# EAGLE board Led_panel_v2.0 (EAGLE 9.5.2)
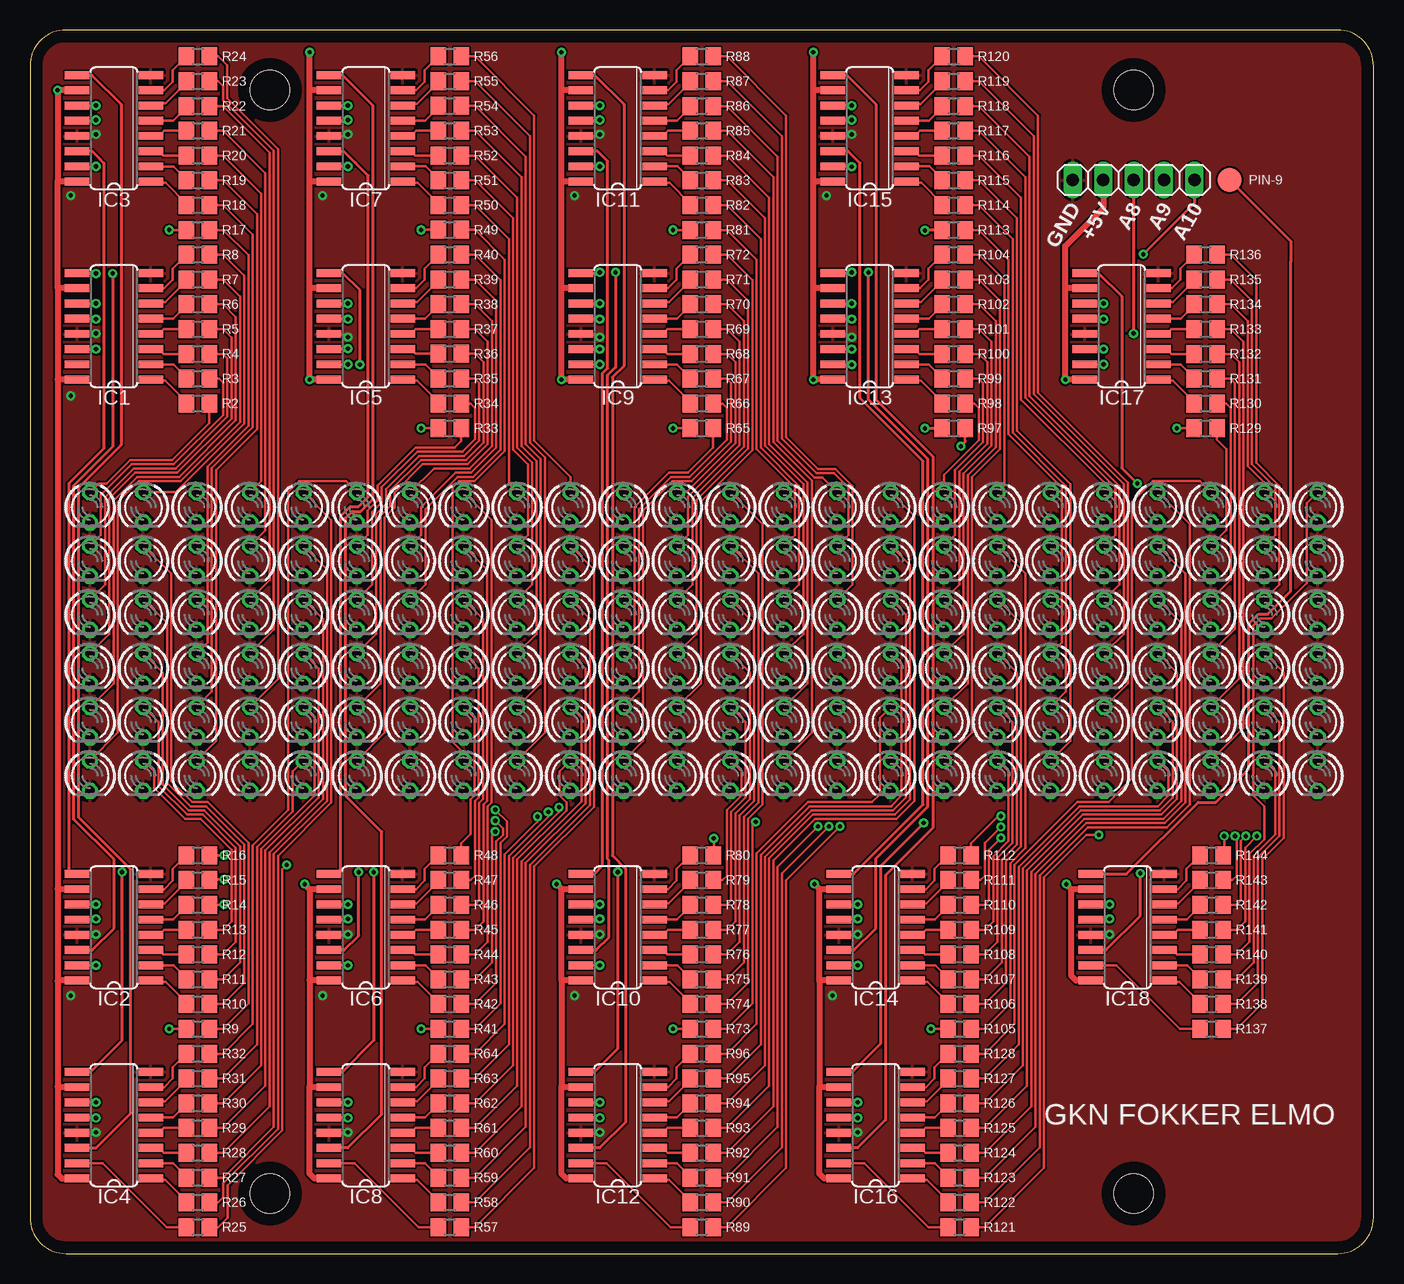
[diagram p1: board, top side]
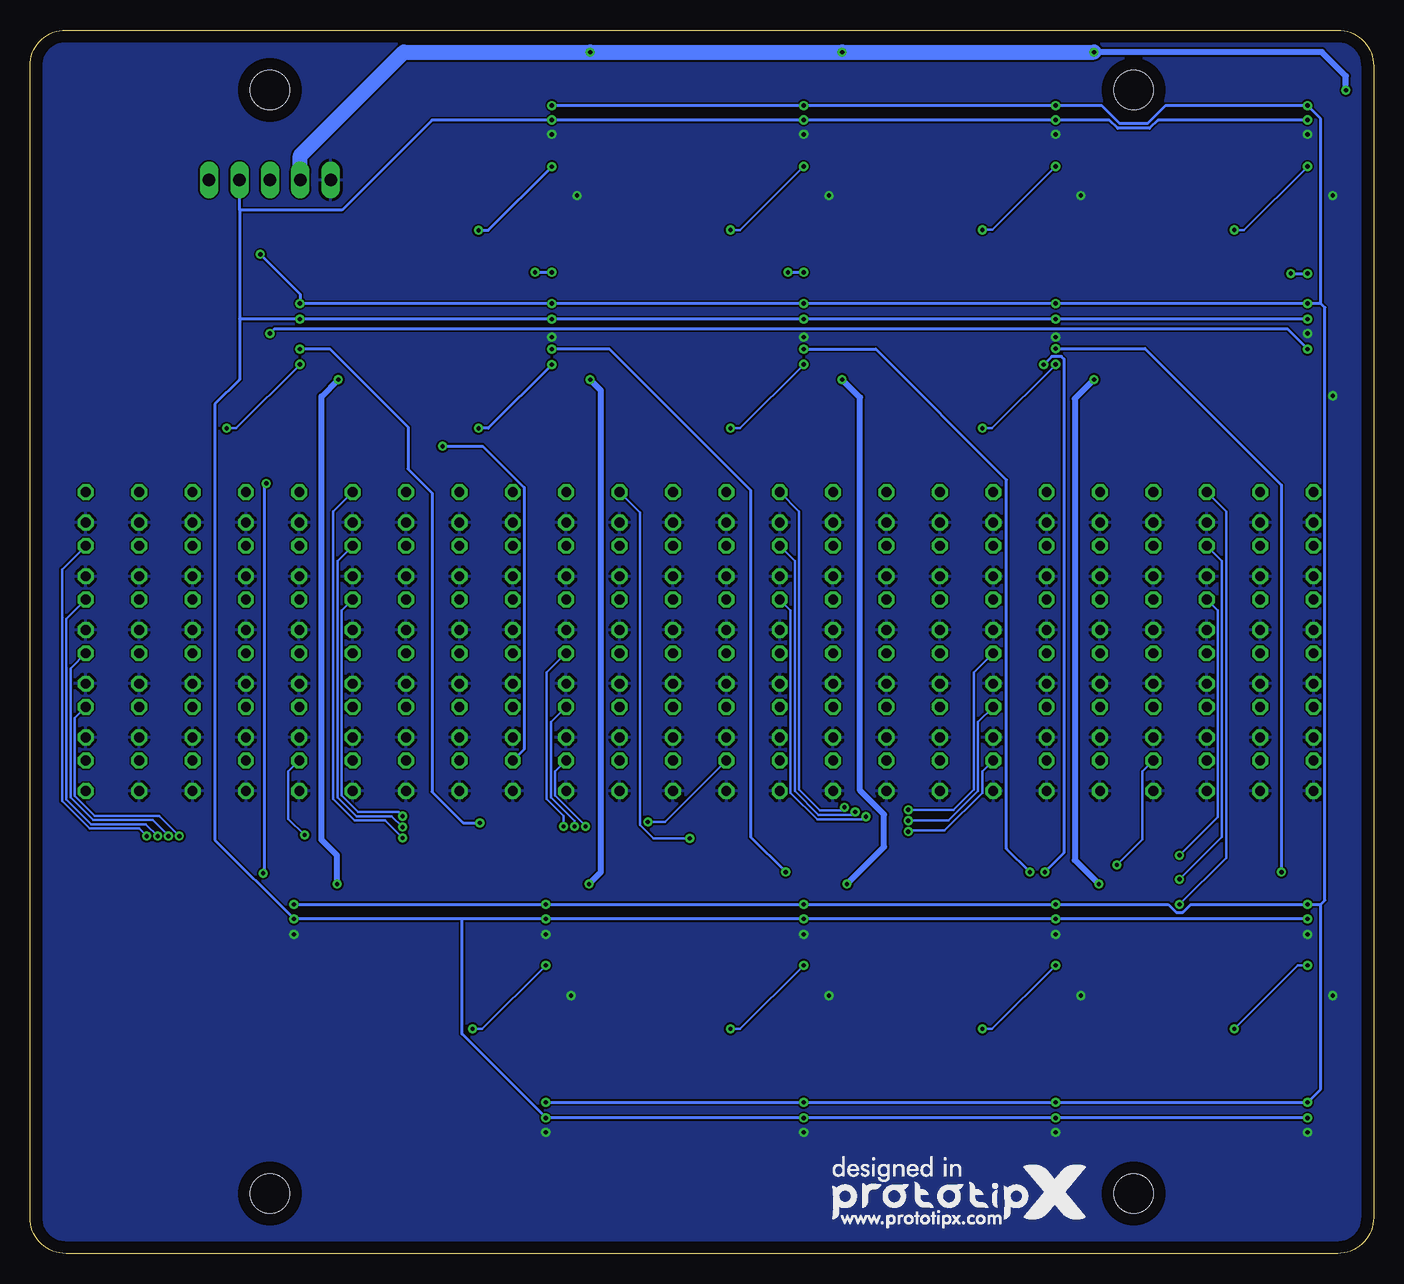
[diagram p2: board, bottom side, seen from below]

Size 112 x 102 mm. Coordinates in mm from the lower left corner, seen from the top.
Outline: 3,0 109,0 arc90 112,3 112,99 arc90 109,102 3,102 arc90 0,99 0,3 arc90 3,0
Copper layers (1*16): Top 0.035mm / dielectric 1.5mm / Bottom 0.035mm
Design rules "default": minimum track width 6mil, minimum drill 0.35mm, track to track 6mil, track to pad 6mil, pad to pad 6mil, via to via 6mil, smd to smd 6mil, copper to edge 40mil, drill to drill 6mil, minimum pad ring 10mil, minimum via ring 8mil, stop-mask expansion 4mil, vias tented up to drill 0mil, thermal gap 10mil
Holes 3.3 mm at 20,5 92,5 92,97 20,97

## Footprints (pad centres in the part's own frame; a part is rotated, then mirrored left to right if it is on the bottom)
SO16 = smd 0.66 x 2.032: 1 -4.445,-3.073; 2 -3.175,-3.073; 3 -1.905,-3.073; 4 -0.635,-3.073; 5 0.635,-3.073; 6 1.905,-3.073; 7 3.175,-3.073; 8 4.445,-3.073; 9 4.445,3.073; 10 3.175,3.073; 11 1.905,3.073; 12 0.635,3.073; 13 -0.635,3.073; 14 -1.905,3.073; 15 -3.175,3.073; 16 -4.445,3.073
1X05 = drill 1.016 long: 1 -5.08,0; 2 -2.54,0; 3 0,0; 4 2.54,0; 5 5.08,0
LED3MM = drill 0.813 octagon: A -1.27,0; K 1.27,0
TP20R = smd 2 x 2: TP 0,0
R0805 = smd 1.3 x 1.5: 1 -0.95,0; 2 0.95,0

## Placement (x,y rotation side)
IC1  74HC595D  [SO16]  7,77.3 90 top
IC2  74HC595D  [SO16]  7,27.2 90 top
IC3  74HC595D  [SO16]  7,93.8 90 top
IC4  74HC595D  [SO16]  7,10.7 90 top
IC5  74HC595D  [SO16]  28,77.3 90 top
IC6  74HC595D  [SO16]  28,27.2 90 top
IC7  74HC595D  [SO16]  28,93.8 90 top
IC8  74HC595D  [SO16]  28,10.7 90 top
IC9  74HC595D  [SO16]  49,77.3 90 top
IC10  74HC595D  [SO16]  49,27.2 90 top
IC11  74HC595D  [SO16]  49,93.8 90 top
IC12  74HC595D  [SO16]  49,10.7 90 top
IC13  74HC595D  [SO16]  70,77.3 90 top
IC14  74HC595D  [SO16]  70.5,27.2 90 top
IC15  74HC595D  [SO16]  70,93.8 90 top
IC16  74HC595D  [SO16]  70.5,10.7 90 top
IC17  74HC595D  [SO16]  91,77.3 90 top
IC18  74HC595D  [SO16]  91.5,27.2 90 top
JP1  [1X05]  92,89.5 0 top
LED1  [LED3MM]  107.35,39.83 270 top
LED2  [LED3MM]  5,62.2 270 top
LED3  [LED3MM]  5,57.73 270 top
LED4  [LED3MM]  5,53.25 270 top
LED5  [LED3MM]  5,48.77 270 top
LED6  [LED3MM]  5,44.3 270 top
LED7  [LED3MM]  5,39.83 270 top
LED8  [LED3MM]  9.45,62.2 270 top
LED9  [LED3MM]  9.45,57.73 270 top
LED10  [LED3MM]  9.45,53.25 270 top
LED11  [LED3MM]  9.45,48.77 270 top
LED12  [LED3MM]  9.45,44.3 270 top
LED13  [LED3MM]  9.45,39.83 270 top
LED14  [LED3MM]  13.9,62.2 270 top
LED15  [LED3MM]  13.9,57.73 270 top
LED16  [LED3MM]  13.9,53.25 270 top
LED17  [LED3MM]  13.9,48.77 270 top
LED18  [LED3MM]  13.9,44.3 270 top
LED19  [LED3MM]  13.9,39.83 270 top
LED20  [LED3MM]  18.35,62.2 270 top
LED21  [LED3MM]  18.35,57.73 270 top
LED22  [LED3MM]  18.35,53.25 270 top
LED23  [LED3MM]  18.35,48.77 270 top
LED24  [LED3MM]  18.35,44.3 270 top
LED25  [LED3MM]  18.35,39.83 270 top
LED26  [LED3MM]  22.8,62.2 270 top
LED27  [LED3MM]  22.8,57.73 270 top
LED28  [LED3MM]  22.8,53.25 270 top
LED29  [LED3MM]  22.8,48.77 270 top
LED30  [LED3MM]  22.8,44.3 270 top
LED31  [LED3MM]  22.8,39.83 270 top
LED32  [LED3MM]  27.25,62.2 270 top
LED33  [LED3MM]  27.25,57.73 270 top
LED34  [LED3MM]  27.25,53.25 270 top
LED35  [LED3MM]  27.25,48.77 270 top
LED36  [LED3MM]  27.25,44.3 270 top
LED37  [LED3MM]  27.25,39.83 270 top
LED38  [LED3MM]  31.7,62.2 270 top
LED39  [LED3MM]  31.7,57.73 270 top
LED40  [LED3MM]  31.7,53.25 270 top
LED41  [LED3MM]  31.7,48.77 270 top
LED42  [LED3MM]  31.7,44.3 270 top
LED43  [LED3MM]  31.7,39.83 270 top
LED44  [LED3MM]  36.15,62.2 270 top
LED45  [LED3MM]  36.15,57.73 270 top
LED46  [LED3MM]  36.15,53.25 270 top
LED47  [LED3MM]  36.15,48.77 270 top
LED48  [LED3MM]  36.15,44.3 270 top
LED49  [LED3MM]  36.15,39.83 270 top
LED50  [LED3MM]  40.6,62.2 270 top
LED51  [LED3MM]  40.6,57.73 270 top
LED52  [LED3MM]  40.6,53.25 270 top
LED53  [LED3MM]  40.6,48.77 270 top
LED54  [LED3MM]  40.6,44.3 270 top
LED55  [LED3MM]  40.6,39.83 270 top
LED56  [LED3MM]  45.05,62.2 270 top
LED57  [LED3MM]  45.05,57.73 270 top
LED58  [LED3MM]  45.05,53.25 270 top
LED59  [LED3MM]  45.05,48.77 270 top
LED60  [LED3MM]  45.05,44.3 270 top
LED61  [LED3MM]  45.05,39.83 270 top
LED62  [LED3MM]  49.5,62.2 270 top
LED63  [LED3MM]  49.5,57.73 270 top
LED64  [LED3MM]  49.5,53.25 270 top
LED65  [LED3MM]  49.5,48.77 270 top
LED66  [LED3MM]  49.5,44.3 270 top
LED67  [LED3MM]  49.5,39.83 270 top
LED68  [LED3MM]  53.95,62.2 270 top
LED69  [LED3MM]  53.95,57.73 270 top
LED70  [LED3MM]  53.95,53.25 270 top
LED71  [LED3MM]  53.95,48.77 270 top
LED72  [LED3MM]  53.95,44.3 270 top
LED73  [LED3MM]  53.95,39.83 270 top
LED74  [LED3MM]  58.4,62.2 270 top
LED75  [LED3MM]  58.4,57.73 270 top
LED76  [LED3MM]  58.4,53.25 270 top
LED77  [LED3MM]  58.4,48.77 270 top
LED78  [LED3MM]  58.4,44.3 270 top
LED79  [LED3MM]  58.4,39.83 270 top
LED80  [LED3MM]  62.85,62.2 270 top
LED81  [LED3MM]  62.85,57.73 270 top
LED82  [LED3MM]  62.85,53.25 270 top
LED83  [LED3MM]  62.85,48.77 270 top
LED84  [LED3MM]  62.85,44.3 270 top
LED85  [LED3MM]  62.85,39.83 270 top
LED86  [LED3MM]  67.3,62.2 270 top
LED87  [LED3MM]  67.3,57.73 270 top
LED88  [LED3MM]  67.3,53.25 270 top
LED89  [LED3MM]  67.3,48.77 270 top
LED90  [LED3MM]  67.3,44.3 270 top
LED91  [LED3MM]  67.3,39.83 270 top
LED92  [LED3MM]  71.75,62.2 270 top
LED93  [LED3MM]  71.75,57.73 270 top
LED94  [LED3MM]  71.75,53.25 270 top
LED95  [LED3MM]  71.75,48.77 270 top
LED96  [LED3MM]  71.75,44.3 270 top
LED97  [LED3MM]  71.75,39.83 270 top
LED98  [LED3MM]  76.2,62.2 270 top
LED99  [LED3MM]  76.2,57.73 270 top
LED100  [LED3MM]  76.2,53.25 270 top
LED101  [LED3MM]  76.2,48.77 270 top
LED102  [LED3MM]  76.2,44.3 270 top
LED103  [LED3MM]  76.2,39.83 270 top
LED104  [LED3MM]  80.65,62.2 270 top
LED105  [LED3MM]  80.65,57.73 270 top
LED106  [LED3MM]  80.65,53.25 270 top
LED107  [LED3MM]  80.65,48.77 270 top
LED108  [LED3MM]  80.65,44.3 270 top
LED109  [LED3MM]  80.65,39.83 270 top
LED110  [LED3MM]  85.1,62.2 270 top
LED111  [LED3MM]  85.1,57.73 270 top
LED112  [LED3MM]  85.1,53.25 270 top
LED113  [LED3MM]  85.1,48.77 270 top
LED114  [LED3MM]  85.1,44.3 270 top
LED115  [LED3MM]  85.1,39.83 270 top
LED116  [LED3MM]  89.55,62.2 270 top
LED117  [LED3MM]  89.55,57.73 270 top
LED118  [LED3MM]  89.55,53.25 270 top
LED119  [LED3MM]  89.55,48.77 270 top
LED120  [LED3MM]  89.55,44.3 270 top
LED121  [LED3MM]  89.55,39.83 270 top
LED122  [LED3MM]  94,62.2 270 top
LED123  [LED3MM]  94,57.73 270 top
LED124  [LED3MM]  94,53.25 270 top
LED125  [LED3MM]  94,48.77 270 top
LED126  [LED3MM]  94,44.3 270 top
LED127  [LED3MM]  94,39.83 270 top
LED128  [LED3MM]  98.45,62.2 270 top
LED129  [LED3MM]  98.45,57.73 270 top
LED130  [LED3MM]  98.45,53.25 270 top
LED131  [LED3MM]  98.45,48.77 270 top
LED132  [LED3MM]  98.45,44.3 270 top
LED133  [LED3MM]  98.45,39.83 270 top
LED134  [LED3MM]  102.9,62.2 270 top
LED135  [LED3MM]  102.9,57.73 270 top
LED136  [LED3MM]  102.9,53.25 270 top
LED137  [LED3MM]  102.9,48.77 270 top
LED138  [LED3MM]  102.9,44.3 270 top
LED139  [LED3MM]  102.9,39.83 270 top
LED140  [LED3MM]  107.35,62.2 270 top
LED141  [LED3MM]  107.35,57.73 270 top
LED142  [LED3MM]  107.35,53.25 270 top
LED143  [LED3MM]  107.35,48.77 270 top
LED144  [LED3MM]  107.35,44.3 270 top
PIN-9  PTR1TP20R  [TP20R]  100,89.5 0 top
R2  120R  [R0805]  14,70.87 0 top
R3  120R  [R0805]  14,72.93 0 top
R4  120R  [R0805]  14,75 0 top
R5  120R  [R0805]  14,77.07 0 top
R6  120R  [R0805]  14,79.13 0 top
R7  120R  [R0805]  14,81.2 0 top
R8  120R  [R0805]  14,83.27 0 top
R9  120R  [R0805]  14,18.73 0 top
R10  120R  [R0805]  14,20.8 0 top
R11  120R  [R0805]  14,22.87 0 top
R12  120R  [R0805]  14,24.93 0 top
R13  120R  [R0805]  14,27 0 top
R14  120R  [R0805]  14,29.07 0 top
R15  120R  [R0805]  14,31.13 0 top
R16  120R  [R0805]  14,33.2 0 top
R17  120R  [R0805]  14,85.33 0 top
R18  120R  [R0805]  14,87.4 0 top
R19  120R  [R0805]  14,89.47 0 top
R20  120R  [R0805]  14,91.53 0 top
R21  120R  [R0805]  14,93.6 0 top
R22  120R  [R0805]  14,95.67 0 top
R23  120R  [R0805]  14,97.73 0 top
R24  120R  [R0805]  14,99.8 0 top
R25  120R  [R0805]  14,2.2 0 top
R26  120R  [R0805]  14,4.27 0 top
R27  120R  [R0805]  14,6.33 0 top
R28  120R  [R0805]  14,8.4 0 top
R29  120R  [R0805]  14,10.47 0 top
R30  120R  [R0805]  14,12.53 0 top
R31  120R  [R0805]  14,14.6 0 top
R32  120R  [R0805]  14,16.67 0 top
R33  120R  [R0805]  35,68.8 0 top
R34  120R  [R0805]  35,70.87 0 top
R35  120R  [R0805]  35,72.93 0 top
R36  120R  [R0805]  35,75 0 top
R37  120R  [R0805]  35,77.07 0 top
R38  120R  [R0805]  35,79.13 0 top
R39  120R  [R0805]  35,81.2 0 top
R40  120R  [R0805]  35,83.27 0 top
R41  120R  [R0805]  35,18.73 0 top
R42  120R  [R0805]  35,20.8 0 top
R43  120R  [R0805]  35,22.87 0 top
R44  120R  [R0805]  35,24.93 0 top
R45  120R  [R0805]  35,27 0 top
R46  120R  [R0805]  35,29.07 0 top
R47  120R  [R0805]  35,31.13 0 top
R48  120R  [R0805]  35,33.2 0 top
R49  120R  [R0805]  35,85.33 0 top
R50  120R  [R0805]  35,87.4 0 top
R51  120R  [R0805]  35,89.47 0 top
R52  120R  [R0805]  35,91.53 0 top
R53  120R  [R0805]  35,93.6 0 top
R54  120R  [R0805]  35,95.67 0 top
R55  120R  [R0805]  35,97.73 0 top
R56  120R  [R0805]  35,99.8 0 top
R57  120R  [R0805]  35,2.2 0 top
R58  120R  [R0805]  35,4.27 0 top
R59  120R  [R0805]  35,6.33 0 top
R60  120R  [R0805]  35,8.4 0 top
R61  120R  [R0805]  35,10.47 0 top
R62  120R  [R0805]  35,12.53 0 top
R63  120R  [R0805]  35,14.6 0 top
R64  120R  [R0805]  35,16.67 0 top
R65  120R  [R0805]  56,68.8 0 top
R66  120R  [R0805]  56,70.87 0 top
R67  120R  [R0805]  56,72.93 0 top
R68  120R  [R0805]  56,75 0 top
R69  120R  [R0805]  56,77.07 0 top
R70  120R  [R0805]  56,79.13 0 top
R71  120R  [R0805]  56,81.2 0 top
R72  120R  [R0805]  56,83.27 0 top
R73  120R  [R0805]  56,18.73 0 top
R74  120R  [R0805]  56,20.8 0 top
R75  120R  [R0805]  56,22.87 0 top
R76  120R  [R0805]  56,24.93 0 top
R77  120R  [R0805]  56,27 0 top
R78  120R  [R0805]  56,29.07 0 top
R79  120R  [R0805]  56,31.13 0 top
R80  120R  [R0805]  56,33.2 0 top
R81  120R  [R0805]  56,85.33 0 top
R82  120R  [R0805]  56,87.4 0 top
R83  120R  [R0805]  56,89.47 0 top
R84  120R  [R0805]  56,91.53 0 top
R85  120R  [R0805]  56,93.6 0 top
R86  120R  [R0805]  56,95.67 0 top
R87  120R  [R0805]  56,97.73 0 top
R88  120R  [R0805]  56,99.8 0 top
R89  120R  [R0805]  56,2.2 0 top
R90  120R  [R0805]  56,4.27 0 top
R91  120R  [R0805]  56,6.33 0 top
R92  120R  [R0805]  56,8.4 0 top
R93  120R  [R0805]  56,10.47 0 top
R94  120R  [R0805]  56,12.53 0 top
R95  120R  [R0805]  56,14.6 0 top
R96  120R  [R0805]  56,16.67 0 top
R97  120R  [R0805]  77,68.8 0 top
R98  120R  [R0805]  77,70.87 0 top
R99  120R  [R0805]  77,72.93 0 top
R100  120R  [R0805]  77,75 0 top
R101  120R  [R0805]  77,77.07 0 top
R102  120R  [R0805]  77,79.13 0 top
R103  120R  [R0805]  77,81.2 0 top
R104  120R  [R0805]  77,83.27 0 top
R105  120R  [R0805]  77.5,18.73 0 top
R106  120R  [R0805]  77.5,20.8 0 top
R107  120R  [R0805]  77.5,22.87 0 top
R108  120R  [R0805]  77.5,24.93 0 top
R109  120R  [R0805]  77.5,27 0 top
R110  120R  [R0805]  77.5,29.07 0 top
R111  120R  [R0805]  77.5,31.13 0 top
R112  120R  [R0805]  77.5,33.2 0 top
R113  120R  [R0805]  77,85.33 0 top
R114  120R  [R0805]  77,87.4 0 top
R115  120R  [R0805]  77,89.47 0 top
R116  120R  [R0805]  77,91.53 0 top
R117  120R  [R0805]  77,93.6 0 top
R118  120R  [R0805]  77,95.67 0 top
R119  120R  [R0805]  77,97.73 0 top
R120  120R  [R0805]  77,99.8 0 top
R121  120R  [R0805]  77.5,2.2 0 top
R122  120R  [R0805]  77.5,4.27 0 top
R123  120R  [R0805]  77.5,6.33 0 top
R124  120R  [R0805]  77.5,8.4 0 top
R125  120R  [R0805]  77.5,10.47 0 top
R126  120R  [R0805]  77.5,12.53 0 top
R127  120R  [R0805]  77.5,14.6 0 top
R128  120R  [R0805]  77.5,16.67 0 top
R129  120R  [R0805]  98,68.8 0 top
R130  120R  [R0805]  98,70.87 0 top
R131  120R  [R0805]  98,72.93 0 top
R132  120R  [R0805]  98,75 0 top
R133  120R  [R0805]  98,77.07 0 top
R134  120R  [R0805]  98,79.13 0 top
R135  120R  [R0805]  98,81.2 0 top
R136  120R  [R0805]  98,83.27 0 top
R137  120R  [R0805]  98.5,18.73 0 top
R138  120R  [R0805]  98.5,20.8 0 top
R139  120R  [R0805]  98.5,22.87 0 top
R140  120R  [R0805]  98.5,24.93 0 top
R141  120R  [R0805]  98.5,27 0 top
R142  120R  [R0805]  98.5,29.07 0 top
R143  120R  [R0805]  98.5,31.13 0 top
R144  120R  [R0805]  98.5,33.2 0 top

## Tracks (layer width: path | path; a pad name or v marks a point on that pad's centre or on a via)
+5V  (via drill 0.35)
  Top 0.508: IC1.16 2.3,72.86 | 2.3,80.5 2.3,72.86 | 2.3,80.5 2.3,89.4 | IC3.16 2.35,89.36 2.3,89.4 | IC1.10 2.33,80.47 2.3,80.5 | IC5.16 v23.3,72.86 23.3,80.5 | 23.3,80.5 23.3,89.4 | 23.3,89.4 23.3,97 | IC7.10 23.32,96.97 23.3,97 | IC7.16 23.34,89.36 23.3,89.4 | IC5.10 23.32,80.47 23.3,80.5 | IC9.16 v44.3,72.86 44.3,80.5 | 44.3,80.5 44.3,89.4 | 44.3,89.4 44.3,97 | IC11.10 44.33,96.97 44.3,97 | IC11.16 44.34,89.36 44.3,89.4 | IC9.10 44.33,80.47 44.3,80.5 | IC13.16 v65.3,72.86 65.3,80.5 | 65.3,80.5 65.3,89.4 | 65.3,89.4 65.3,97 | IC15.10 65.33,96.97 65.3,97 | IC15.16 65.34,89.36 65.3,89.4 | IC13.10 65.33,80.47 65.3,80.5 | IC17.16 v86.3,72.86 86.3,80.5 | IC17.10 86.33,80.47 86.3,80.5 | 23.3,97 v23.3,100.15 | 44.3,97 v44.3,100.15 | 65.3,97 v65.3,100.15 | JP1.2 89.46,87.16 86.3,84 86.3,80.5 | 2.3,89.4 v2.3,96.97 IC3.10 | IC4.16 2.65,6.25 2.3,6.6 2.3,13.9 | 2.3,22.7 2.3,13.9 | IC2.16 2.35,22.75 2.3,22.7 | IC4.10 2.33,13.88 2.3,13.9 | IC6.10 23.3,30.38 | 23.3,30.38 23.3,22.8 | 23.3,22.8 23.3,13.9 | IC8.16 23.7,6.25 23.3,6.66 23.3,13.9 | IC8.10 23.32,13.88 23.3,13.9 | IC6.16 23.34,22.75 23.3,22.8 | IC10.10 44.3,30.38 | 44.3,22.8 44.3,30.38 | 44.3,22.8 44.3,13.9 | IC12.16 44.7,6.25 44.3,6.66 44.3,13.9 | IC12.10 44.33,13.88 44.3,13.9 | IC10.16 44.34,22.75 44.3,22.8 | IC14.10 65.8,30.38 | 65.8,22.7 65.8,30.38 | 65.8,22.7 65.8,13.9 | IC16.16 66.2,6.25 65.8,6.66 65.8,13.9 | IC16.10 65.83,13.88 65.8,13.9 | IC14.16 65.86,22.75 65.8,22.7 | IC18.16 87.2,22.75 86.8,23.16 86.8,30.38 | IC18.10 86.8,30.38 | 2.3,72.86 2.3,30.4 | 2.3,30.4 2.3,22.7 | IC2.10 2.33,30.38 2.3,30.4 | 23.3,30.38 22.9,30.77 v22.9,30.8 | 44.3,30.38 44.3,30.4 v43.9,30.8 | 65.8,30.38 65.8,30.4 v65.4,30.8 | 86.8,30.38 86.4,30.77 v86.4,30.8
  Bottom 0.508: v2.3,96.97 2.3,98.15 4.3,100.15 v23.3,100.15 | v22.9,30.8 24.9,32.8 24.9,71.25 v23.3,72.86 | v43.9,30.8 40.8,33.9 40.8,36.6 42.8,38.6 42.8,71.36 v44.3,72.86 | v65.4,30.8 64.4,31.8 64.4,71.95 v65.3,72.86 | v86.4,30.8 86.4,33.2 87.7,34.5 87.7,71.45 v86.3,72.86
  Bottom 1.27: JP1.2 89.46,91.54 80.85,100.15 v65.3,100.15 v44.3,100.15 v23.3,100.15
A8  (via drill 0.35)
  Top 0.254: IC1.14 v5.5,75.39 v5.5,75.4 | v92,76.7 JP1.3
  Bottom 0.254: v5.5,75.4 7.2,77.1 91.6,77.1 v92,76.7
A9  (via drill 0.35)
  Top 0.254: IC2.12 5.43,27.84 v5.5,27.9 | IC4.12 5.46,11.34 v5.5,11.3 | IC8.12 26.46,11.34 v26.5,11.3 | IC12.12 47.47,11.34 v47.5,11.3 | v69,11.3 67.46,11.3 IC16.12 | IC3.12 5.43,94.44 v5.5,94.5 | v68.5,94.5 68.44,94.44 IC15.12 | IC11.12 47.44,94.44 v47.5,94.5 | IC7.12 26.43,94.44 v26.5,94.5 | IC1.12 5.46,77.94 v5.5,77.9 | v89.5,77.9 89.47,77.94 IC17.12 | IC13.12 68.47,77.94 v68.5,77.9 | IC9.12 47.47,77.94 v47.5,77.9 | IC5.12 26.46,77.94 v26.5,77.9 | v69,27.9 68.94,27.84 IC14.12 | IC10.12 47.44,27.84 v47.5,27.9 | IC6.12 26.43,27.84 v26.5,27.9 | IC18.12 89.94,27.84 v90,27.9
  Bottom 0.254: v5.5,27.9 v26.5,27.9 v47.5,27.9 v69,27.9 76,27.9 | 76,27.9 v90,27.9 96.6,34.5 96.6,70.8 94.54,72.86 94.54,77.9 | v5.5,11.3 v26.5,11.3 v47.5,11.3 v69,11.3 76,18.3 76,27.9 | v5.5,94.5 17.98,94.5 18.68,93.8 21.32,93.8 22.02,94.5 v26.5,94.5 v47.5,94.5 v68.5,94.5 78.5,94.5 86,87 94.54,87 | v5.5,77.9 v26.5,77.9 v47.5,77.9 v68.5,77.9 v89.5,77.9 94.54,77.9 | 94.54,87 JP1.4 | 94.54,87 94.54,77.9
A10  (via drill 0.35)
  Top 0.254: IC18.11 v90,29.11 v90,29.1 | v5.5,29.1 IC2.11 | IC6.11 v26.5,29.11 v26.5,29.1 | IC10.11 v47.49,29.11 v47.5,29.1 | IC14.11 v69,29.11 v69,29.1 | IC16.11 v69,12.61 v69,12.6 | v5.5,12.6 IC4.11 | IC8.11 v26.5,12.61 v26.5,12.6 | IC12.11 v47.49,12.61 v47.5,12.6 | IC3.11 v5.5,95.7 | v68.5,95.7 IC15.11 | IC11.11 v47.49,95.7 v47.5,95.7 | IC7.11 v26.5,95.7 | IC1.11 v5.5,79.2 | v89.5,79.2 IC17.11 | IC13.11 v68.5,79.2 | IC9.11 v47.49,79.2 v47.5,79.2 | IC5.11 v26.5,79.2 | v92.8,83.3 97.1,87.6 97.1,89.48 JP1.5
  Bottom 0.254: v90,29.1 v69,29.1 v47.5,29.1 v26.5,29.1 17.1,29.1 16.45,28.44 15.9,28.44 15.24,29.1 v5.5,29.1 4.4,29.1 | v69,12.6 v47.5,12.6 v26.5,12.6 v5.5,12.6 4.4,13.7 4.4,29.1 | v68.5,95.7 v47.5,95.7 v26.5,95.7 22.65,95.7 21.16,94.21 18.84,94.21 17.35,95.7 v5.5,95.7 4.4,94.6 4.4,79.2 | 4.4,79.2 v5.5,79.2 v26.5,79.2 v47.5,79.2 v68.5,79.2 v89.5,79.2 89.5,80 v92.8,83.3 | 4.4,29.1 4.06,29.44 4.06,78.86 4.4,79.2
GND  (via drill 0.35)
  other vias: 24.4,88.2 45.4,88.2 66.4,88.2 3.4,88.2 26.5,93.3 47.5,93.3 68.5,93.3 5.5,93.3 69,10.1 47.5,10.1 26.5,10.1 5.5,10.1 69,26.6 47.5,26.6 26.5,26.6 5.5,26.6 90,26.6 3.4,21.5 24.4,21.5 45.4,21.5 66.9,21.5 3.4,71.5 5.5,76.7 26.5,76.4 47.5,76.4 68.5,76.4
  pour Top: 3,0 arc-90 0,3 0,99 arc-90 3,102 109,102 arc-90 112,99 112,3 arc-90 109,0
  pour Bottom: 0,99 0,3 arc90 3,0 109,0 arc90 112,3 112,99 arc90 109,102 3,102 arc90
N$1
  Top 0.254: IC18.9 91.41,31.64 97.38,37.62 98.84,37.62 101.6,40.38 101.6,52 101.61,52.01 101.61,52.52 102.4,53.31 103.2,53.31 105.1,55.21 105.1,82.7 105.1,84.4 PIN-9.TP
N$3
  Top 0.2: R2.1 13.05,70.97 11.26,72.75 10.17,72.75 IC1.1
N$4
  Top 0.2: LED2.A 5.73,64.2 6.4,64.2 8.34,66.14 11.85,66.14 14.95,69.25 R2.2
N$5
  Top 0.2: R3.1 13.05,73.03 11.96,74.12 IC1.2
N$6
  Top 0.2: LED3.A 5.91,59.91 5.91,63.22 8.49,65.79 11.99,65.79 16.1,69.9 16.1,72.6 15.77,72.93 R3.2
N$7
  Top 0.2: R4.1 11.15,75 10.76,75.39 IC1.3
N$8
  Top 0.2: LED4.A 6.26,55.78 6.26,63.07 8.63,65.44 12.14,65.44 16.45,69.75 16.45,74.65 16.1,75 R4.2
N$9
  Top 0.2: R5.1 11.16,77.07 10.76,76.67 IC1.4
N$10
  Top 0.2: LED5.A 6.62,51.66 6.62,62.92 8.78,65.09 12.28,65.09 16.8,69.61 16.8,76.36 16.1,77.07 R5.2
N$11
  Top 0.2: R6.1 13.05,79.03 11.95,77.94 IC1.5
N$12
  Top 0.2: LED6.A 6.97,47.54 6.97,62.78 8.93,64.73 12.43,64.73 17.16,69.46 17.16,78.08 16.1,79.13 R6.2
N$13
  Top 0.2: R7.1 13.05,81.1 11.26,79.31 10.17,79.31 IC1.6
N$14
  Top 0.2: LED7.A 7.32,43.42 7.32,62.63 9.07,64.38 12.58,64.38 17.51,69.32 17.51,79.79 16.1,81.2 R7.2
N$15
  Top 0.2: IC1.7 11.18,80.47 11.9,81.2 11.9,82.12 R8.1
N$16
  Top 0.2: R8.2 16.1,83.27 17.86,81.5 17.86,69.17 12.16,63.47 LED8.A
N$17  (via drill 0.35)
  Top 0.2: v5.5,24.02 IC2.15 | R9.1 v11.6,18.73
  Bottom 0.2: v11.6,18.73 6.31,24.02 v5.5,24.02
N$18
  Top 0.2: LED9.A 11.77,56.67 11.77,39.39 13.52,37.64 14.82,37.64 18.21,34.25 18.21,20.85 16.1,18.73 R9.2
N$19
  Top 0.2: R10.1 13.05,20.9 11.29,22.66 10.17,22.66 IC2.1
N$20
  Top 0.2: LED10.A 11.42,52.55 11.42,39.25 13.38,37.29 14.67,37.29 17.86,34.1 17.86,22.56 16.1,20.8 R10.2
N$21
  Top 0.2: R11.1 13.05,22.97 11.99,24.02 IC2.2
N$22
  Top 0.2: LED11.A 11.07,48.43 11.07,39.1 13.23,36.94 14.53,36.94 17.51,33.95 17.51,24.28 16.1,22.87 R11.2
N$23
  Top 0.2: R12.1 11.12,24.93 10.76,25.3 IC2.3
N$24
  Top 0.2: LED12.A 10.71,44.3 10.71,38.95 13.08,36.59 14.38,36.59 17.16,33.81 17.16,25.99 16.1,24.93 R12.2
N$25
  Top 0.2: R13.1 11.19,27 10.76,26.57 IC2.4
N$26
  Top 0.2: LED13.A 10.36,40.18 10.36,38.81 12.94,36.23 14.23,36.23 16.8,33.66 16.8,27.7 16.1,27 R13.2
N$27
  Top 0.2: R14.1 13.05,28.97 11.92,27.84 IC2.5
N$28  (via drill 0.35)
  Top 0.2: R14.2 16.14,29.07 v16.17,29.1
  Bottom 0.2: LED14.A 12.28,61.85 12.28,32.99 v16.17,29.1
N$29
  Top 0.2: R15.1 13.05,31.03 11.22,29.2 10.17,29.2 IC2.6
N$30  (via drill 0.35)
  Top 0.2: R15.2 15.02,31.2 v16.17,31.2
  Bottom 0.2: LED15.A 12.63,57.73 12.63,34.74 v16.17,31.2
N$31
  Top 0.2: IC2.7 11.18,30.38 11.9,31.1 11.9,32.05 R16.1
N$32  (via drill 0.35)
  Top 0.2: R16.2 v16.17,33.2 | v16.17,33.2
  Bottom 0.2: LED16.A 12.99,53.61 12.99,36.39 v16.17,33.2
N$33  (via drill 0.35)
  Top 0.2: v11.6,85.33 R17.1 | IC3.15 v5.5,90.62
  Bottom 0.2: v5.5,90.62 10.79,85.33 v11.6,85.33
N$34
  Top 0.2: LED17.A 14.81,50.96 14.81,65.62 18.21,69.02 18.21,83.22 16.1,85.33 R17.2
N$35
  Top 0.2: R18.1 13.05,87.5 11.29,89.25 10.17,89.25 IC3.1
N$36
  Top 0.2: LED18.A 15.16,46.84 15.16,65.48 18.57,68.88 18.57,84.93 16.1,87.4 R18.2
N$37
  Top 0.2: R19.1 13.05,89.57 11.99,90.62 IC3.2
N$38
  Top 0.2: LED19.A 15.52,42.71 15.52,65.33 18.92,68.73 18.92,86.65 16.1,89.47 R19.2
N$39
  Top 0.2: R20.1 11.12,91.53 10.76,91.89 IC3.3
N$40
  Top 0.2: R20.2 16.1,91.53 19.27,88.36 19.27,64.39 LED20.A
N$41
  Top 0.2: R21.1 11.19,93.6 10.76,93.17 IC3.4
N$42
  Top 0.2: LED21.A 19.62,60.27 19.62,90.08 16.1,93.6 R21.2
N$43
  Top 0.2: R22.1 13.05,95.57 11.92,94.44 IC3.5
N$44
  Top 0.2: LED22.A 19.98,56.15 19.98,91.79 16.1,95.67 R22.2
N$45
  Top 0.2: R23.1 13.05,97.63 11.31,95.89 10.99,95.89 10.8,95.7 IC3.6
N$46
  Top 0.2: LED23.A 20.33,52.02 20.33,91.94 16.1,96.17 16.1,97.33 15.7,97.73 R23.2
N$47
  Top 0.2: IC3.7 11.18,96.97 11.9,97.7 11.9,98.65 R24.1
N$48
  Top 0.2: LED24.A 20.68,47.9 20.68,92.08 16.45,96.31 16.45,99.05 15.7,99.8 R24.2
N$49
  Top 0.2: R25.1 11.38,2.2 6.06,7.53 IC4.15
N$50  (via drill 0.35)
  Top 0.2: R25.2 15.7,2.2 16.47,2.97 16.47,5.71 21.03,10.27 21.03,32.03 v21.4,32.4
  Bottom 0.2: LED25.A 19.26,40.18 19.26,34.54 v21.4,32.4
N$51
  Top 0.2: R26.1 13.05,4.37 11.26,6.16 10.17,6.16 IC4.1
N$52
  Top 0.2: R26.2 15.7,4.27 16.12,4.68 16.12,5.85 20.68,10.42 20.68,33.15 25.12,37.59 25.12,61.15 LED26.A
N$53
  Top 0.2: R27.1 13.05,6.43 11.96,7.53 IC4.2
N$54
  Top 0.2: R27.2 16.1,6.33 20.33,10.56 20.33,33.3 24.77,37.74 24.77,57.02 LED27.A
N$55
  Top 0.2: R28.1 11.15,8.4 10.76,8.79 IC4.3
N$56
  Top 0.2: R28.2 16.1,8.4 19.98,12.28 19.98,33.44 24.42,37.88 24.42,52.9 LED28.A
N$57
  Top 0.2: R29.1 11.16,10.47 10.76,10.06 IC4.4
N$58
  Top 0.2: R29.2 16.1,10.47 19.62,13.99 19.62,33.59 24.07,38.03 24.07,48.78 LED29.A
N$59
  Top 0.2: R30.1 13.05,12.43 11.95,11.34 IC4.5
N$60
  Top 0.2: R30.2 16.1,12.53 19.27,15.71 19.27,33.74 23.71,38.18 23.71,44.66 LED30.A
N$61
  Top 0.2: R31.1 13.05,14.5 11.26,12.71 10.17,12.71 IC4.6
N$62
  Top 0.2: R31.2 16.1,14.6 18.92,17.42 18.92,33.88 21.89,36.85 21.89,40.18 LED31.A
N$63
  Top 0.2: IC4.7 11.18,13.88 11.9,14.6 11.9,15.52 R32.1
N$64
  Top 0.2: R32.2 16.1,16.67 18.57,19.13 18.57,34.03 21.54,37 21.54,63.5 22.42,64.38 26.34,64.38 LED32.A
N$65  (via drill 0.35)
  Top 0.2: R33.1 v32.6,68.8 | IC5.15 v26.5,74.12
  Bottom 0.2: v26.5,74.12 31.82,68.8 v32.6,68.8
N$66
  Top 0.2: LED33.A 28.16,59.91 28.16,61.94 28.98,62.76 28.98,64.03 32.15,67.2 35.4,67.2 35.95,67.75 R33.2
N$67
  Top 0.2: R34.1 34.05,70.97 32.26,72.75 31.17,72.75 IC5.1
N$68
  Top 0.2: LED34.A 28.52,55.78 28.52,61.8 29.33,62.61 29.33,63.88 32.29,66.85 36.05,66.85 37.1,67.9 37.1,70.5 36.73,70.87 R34.2
N$69
  Top 0.2: R35.1 34.05,73.03 32.96,74.12 IC5.2
N$70
  Top 0.2: LED35.A 28.87,51.66 28.87,61.65 29.68,62.46 29.68,63.74 32.44,66.5 36.2,66.5 37.45,67.75 37.45,72.58 37.1,72.93 R35.2
N$71
  Top 0.2: R36.1 32.15,75 31.76,75.39 IC5.3
N$72
  Top 0.2: LED36.A 29.22,47.54 29.22,61.51 30.03,62.32 30.03,63.59 32.59,66.14 36.34,66.14 37.8,67.61 37.8,74.3 37.1,75 R36.2
N$73
  Top 0.2: R37.1 32.16,77.07 31.76,76.67 IC5.4
N$74
  Top 0.2: LED37.A 29.57,43.42 29.57,61.36 30.39,62.17 30.39,63.45 32.73,65.79 36.49,65.79 38.16,67.46 38.16,76.01 37.1,77.07 R37.2
N$75
  Top 0.2: R38.1 34.05,79.03 32.95,77.94 IC5.5
N$76
  Top 0.2: R38.2 37.1,79.13 38.51,77.72 38.51,67.32 36.63,65.44 33.67,65.44 LED38.A
N$77
  Top 0.2: R39.1 34.05,81.1 32.26,79.31 31.17,79.31 IC5.6
N$78
  Top 0.2: LED39.A 32.61,59.91 32.61,62.22 35.48,65.09 36.78,65.09 38.86,67.17 38.86,79.44 37.1,81.2 R39.2
N$79
  Top 0.2: IC5.7 32.17,80.47 32.9,81.2 32.9,82.12 R40.1
N$80
  Top 0.2: LED40.A 32.97,55.78 32.97,62.07 35.63,64.73 36.92,64.73 39.21,67.02 39.21,81.15 37.1,83.27 R40.2
N$81  (via drill 0.35)
  Top 0.2: R41.1 v32.6,18.73 | IC6.15 v26.5,24.02
  Bottom 0.2: v26.5,24.02 31.79,18.73 v32.6,18.73
N$82  (via drill 0.35)
  Top 0.2: R41.2 37.1,18.73 39.21,20.85 39.21,34.21 39.77,34.77 39.77,36.01 v38.79,36.99
  Bottom 0.2: LED41.A 33.32,48.43 33.32,38.69 35.02,36.99 v38.79,36.99
N$83
  Top 0.2: R42.1 34.05,20.9 32.3,22.66 31.17,22.66 IC6.1
N$84  (via drill 0.35)
  Top 0.2: R42.2 37.1,20.8 38.86,22.56 38.86,34.36 39.42,34.91 39.42,35.45 v38.79,36.08
  Bottom 0.2: LED42.A 32.97,44.3 32.97,38.55 35.43,36.08 v38.79,36.08
N$85
  Top 0.2: R43.1 34.05,22.97 32.99,24.02 IC6.2
N$86  (via drill 0.35)
  Top 0.2: R43.2 37.1,22.87 38.51,24.28 38.51,34.9 v38.79,35.17
  Bottom 0.2: v38.79,35.17 38.7,35.26 35.75,35.26 32.61,38.4 32.61,40.2 32.6,40.2 LED43.A
N$87
  Top 0.2: R44.1 32.12,24.93 31.76,25.3 IC6.3
N$88
  Top 0.2: LED44.A 38.47,61.15 38.47,37.59 38.16,37.28 38.16,25.99 37.1,24.93 R44.2
N$89
  Top 0.2: R45.1 32.19,27 31.76,26.57 IC6.4
N$90
  Top 0.2: LED45.A 38.12,57.02 38.12,37.74 37.8,37.42 37.8,27.7 37.1,27 R45.2
N$91
  Top 0.2: R46.1 34.05,28.97 32.92,27.84 IC6.5
N$92
  Top 0.2: LED46.A 37.77,52.9 37.77,37.88 37.45,37.57 37.45,29.42 37.1,29.07 R46.2
N$93
  Top 0.2: R47.1 34.05,31.03 32.22,29.2 31.17,29.2 IC6.6
N$94
  Top 0.2: LED47.A 37.41,48.78 37.41,38.03 37.1,37.72 37.1,31.5 36.73,31.13 R47.2
N$95
  Top 0.2: IC6.7 32.17,30.38 32.9,31.1 32.9,32.05 R48.1
N$96
  Top 0.2: LED48.A 37.06,44.66 37.06,38.18 36.75,37.86 36.75,35 35.95,34.2 R48.2
N$97  (via drill 0.35)
  Top 0.2: v32.6,85.33 R49.1 | IC7.15 v26.5,90.62
  Bottom 0.2: v26.5,90.62 31.79,85.33 v32.6,85.33
N$98
  Top 0.2: R49.2 37.1,85.33 39.57,82.87 39.57,66.88 37.07,64.38 35.77,64.38 35.24,63.85 35.24,42.65 36.15,41.74 LED49.A
N$99
  Top 0.2: R50.1 34.05,87.5 32.3,89.25 31.17,89.25 IC7.1
N$100
  Top 0.2: R50.2 37.1,87.4 39.92,84.58 39.92,64.15 LED50.A
N$101
  Top 0.2: R51.1 34.05,89.57 32.99,90.62 IC7.2
N$102
  Top 0.2: LED51.A 41.51,59.91 41.51,65.79 40.27,67.03 40.27,86.3 37.1,89.47 R51.2
N$103
  Top 0.2: R52.1 32.12,91.53 31.76,91.89 IC7.3
N$104
  Top 0.2: LED52.A 41.87,55.78 41.87,65.93 40.62,67.17 40.62,88.01 37.1,91.53 R52.2
N$105
  Top 0.2: R53.1 32.19,93.6 31.76,93.17 IC7.4
N$106
  Top 0.2: LED53.A 42.22,51.66 42.22,66.08 40.98,67.32 40.98,89.72 37.1,93.6 R53.2
N$107
  Top 0.2: R54.1 34.05,95.57 32.92,94.44 IC7.5
N$108
  Top 0.2: LED54.A 42.57,47.54 42.57,66.22 41.33,67.47 41.33,91.44 37.1,95.67 R54.2
N$109
  Top 0.2: IC7.6 31.76,95.7 31.93,95.87 32.29,95.87 34.05,97.63 R55.1
N$110
  Top 0.2: LED55.A 42.92,43.42 42.92,66.37 41.68,67.61 41.68,93.15 37.1,97.73 R55.2
N$111
  Top 0.2: IC7.7 32.17,96.97 32.9,97.7 32.9,98.65 R56.1
N$112
  Top 0.2: R56.2 37.1,99.8 42.03,94.87 42.03,67.76 45.05,64.74 LED56.A
N$113
  Top 0.2: R57.1 32.38,2.2 27.06,7.53 IC8.15
N$114
  Top 0.2: R57.2 37.1,2.2 42.03,7.13 42.03,32.25 47.02,37.24 47.02,57.02 LED57.A
N$115
  Top 0.2: R58.1 34.05,4.37 32.26,6.16 31.17,6.16 IC8.1
N$116
  Top 0.2: R58.2 37.1,4.27 41.68,8.85 41.68,32.4 46.67,37.39 46.67,52.9 LED58.A
N$117
  Top 0.2: R59.1 34.05,6.43 32.96,7.53 IC8.2
N$118
  Top 0.2: R59.2 37.1,6.33 41.33,10.56 41.33,32.55 46.31,37.53 46.31,48.78 LED59.A
N$119
  Top 0.2: R60.1 32.15,8.4 31.76,8.79 IC8.3
N$120
  Top 0.2: R60.2 37.1,8.4 40.98,12.28 40.98,32.69 45.96,37.68 45.96,44.66 LED60.A
N$121
  Top 0.2: R61.1 32.16,10.47 31.76,10.06 IC8.4
N$122
  Top 0.2: R61.2 37.1,10.47 40.62,13.99 40.62,32.84 44.73,36.94 44.73,37.59 44.14,38.18 44.14,40.18 LED61.A
N$123
  Top 0.2: R62.1 34.05,12.43 32.95,11.34 IC8.5
N$124  (via drill 0.35)
  Top 0.2: R62.2 37.1,12.53 40.27,15.71 40.27,32.98 44.1,36.81 v44.1,37.2
  Bottom 0.2: LED62.A 47.88,61.85 47.88,38.69 46.13,36.94 44.36,36.94 v44.1,37.2
N$125
  Top 0.2: R63.1 34.05,14.5 32.26,12.71 31.17,12.71 IC8.6
N$126  (via drill 0.35)
  Top 0.2: R63.2 37.1,14.6 39.92,17.42 39.92,33.13 43.2,36.42 v43.2,36.81
  Bottom 0.2: LED63.A 48.23,57.73 48.23,38.55 46.26,36.57 43.44,36.57 v43.2,36.8 v43.2,36.81
N$127
  Top 0.2: IC8.7 32.17,13.88 32.9,14.6 32.9,15.52 R64.1
N$128  (via drill 0.35)
  Top 0.2: R64.2 37.1,16.67 39.57,19.13 39.57,33.28 42.31,36.02 v42.31,36.42
  Bottom 0.2: LED64.A 48.59,53.61 48.59,38.4 46.37,36.18 42.55,36.18 v42.31,36.42
N$129  (via drill 0.35)
  Top 0.2: IC9.15 v47.5,74.12 | R65.1 v53.6,68.8
  Bottom 0.2: v47.5,74.12 52.83,68.8 v53.6,68.8
N$130
  Top 0.2: LED65.A 50.41,50.96 50.41,62.22 53.28,65.09 54.84,65.09 56.95,67.2 R65.2
N$131
  Top 0.2: R66.1 55.05,70.97 53.26,72.75 52.17,72.75 IC9.1
N$132
  Top 0.2: LED66.A 50.77,46.84 50.77,62.07 53.43,64.73 54.98,64.73 58.1,67.85 58.1,70.5 57.73,70.87 R66.2
N$133
  Top 0.2: R67.1 55.05,73.03 53.96,74.12 IC9.2
N$134
  Top 0.2: LED67.A 51.12,42.71 51.12,61.93 53.57,64.38 55.13,64.38 58.45,67.7 58.45,72.58 58.1,72.93 R67.2
N$135
  Top 0.2: R68.1 53.15,75 52.76,75.39 IC9.3
N$136
  Top 0.2: R68.2 58.1,75 58.8,74.3 58.8,67.56 54.72,63.47 LED68.A
N$137
  Top 0.2: R69.1 53.16,77.07 52.76,76.67 IC9.4
N$138
  Top 0.2: LED69.A 54.86,59.91 54.86,63.12 59.16,67.41 59.16,76.01 58.1,77.07 R69.2
N$139
  Top 0.2: R70.1 55.05,79.03 53.95,77.94 IC9.5
N$140
  Top 0.2: LED70.A 55.22,55.78 55.22,62.97 59.51,67.27 59.51,77.72 58.1,79.13 R70.2
N$141
  Top 0.2: R71.1 55.05,81.1 53.26,79.31 52.17,79.31 IC9.6
N$142
  Top 0.2: LED71.A 55.57,51.66 55.57,62.83 59.86,67.12 59.86,79.44 58.1,81.2 R71.2
N$143
  Top 0.2: IC9.7 53.17,80.47 53.9,81.2 53.9,82.12 R72.1
N$144
  Top 0.2: LED72.A 55.92,47.54 55.92,62.68 60.21,66.97 60.21,81.15 58.1,83.27 R72.2
N$145  (via drill 0.35)
  Top 0.2: R73.1 v53.6,18.73 | IC10.15 v47.5,24.02
  Bottom 0.2: v47.5,24.02 52.79,18.73 v53.6,18.73
N$146  (via drill 0.35)
  Top 0.2: R73.2 58.1,18.73 60.21,20.85 60.21,35.7 v60.49,35.97
  Bottom 0.2: v60.49,35.97 59.07,35.97 LED73.A
N$147
  Top 0.2: R74.1 55.05,20.9 53.3,22.66 52.17,22.66 IC10.1
N$148
  Top 0.2: LED74.A 61.08,60.8 61.08,37.45 59.86,36.23 59.86,22.56 58.1,20.8 R74.2
N$149
  Top 0.2: R75.1 55.05,22.97 53.99,24.02 IC10.2
N$150
  Top 0.2: LED75.A 60.72,56.67 60.72,37.59 59.51,36.38 59.51,24.28 58.1,22.87 R75.2
N$151
  Top 0.2: R76.1 53.12,24.93 52.76,25.3 IC10.3
N$152
  Top 0.2: LED76.A 60.37,52.55 60.37,37.74 59.16,36.53 59.16,25.99 58.1,24.93 R76.2
N$153
  Top 0.2: R77.1 53.19,27 52.76,26.57 IC10.4
N$154
  Top 0.2: LED77.A 60.02,48.43 60.02,37.88 58.8,36.67 58.8,27.7 58.1,27 R77.2
N$155
  Top 0.2: R78.1 55.05,28.97 53.92,27.84 IC10.5
N$156
  Top 0.2: LED78.A 59.66,44.3 59.66,38.03 58.45,36.82 58.45,29.42 58.1,29.07 R78.2
N$157
  Top 0.2: R79.1 55.05,31.03 53.22,29.2 52.17,29.2 IC10.6
N$158
  Top 0.2: LED79.A 59.31,40.18 59.31,38.18 58.1,36.96 58.1,31.5 57.73,31.13 R79.2
N$159
  Top 0.2: IC10.7 53.17,30.38 53.9,31.1 53.9,32.05 R80.1
N$160  (via drill 0.35)
  Top 0.2: v57,34.6 57,33.25 R80.2
  Bottom 0.2: v57,34.6 60.01,34.6 61.13,35.72 61.13,61.76 LED80.A
N$161  (via drill 0.35)
  Top 0.2: v53.6,85.33 R81.1 | IC11.15 v47.5,90.62
  Bottom 0.2: v47.5,90.62 52.79,85.33 v53.6,85.33
N$162
  Top 0.2: LED81.A 63.76,59.91 63.76,63.85 60.57,67.04 60.57,82.87 58.1,85.33 R81.2
N$163
  Top 0.2: R82.1 55.05,87.5 53.3,89.25 52.17,89.25 IC11.1
N$164
  Top 0.2: LED82.A 64.11,55.78 64.11,63.99 60.92,67.19 60.92,84.58 58.1,87.4 R82.2
N$165
  Top 0.2: R83.1 55.05,89.57 53.99,90.62 IC11.2
N$166
  Top 0.2: LED83.A 64.47,51.66 64.47,64.14 61.27,67.34 61.27,86.3 58.1,89.47 R83.2
N$167
  Top 0.2: R84.1 53.12,91.53 52.76,91.89 IC11.3
N$168
  Top 0.2: LED84.A 64.82,47.54 64.82,64.29 61.62,67.48 61.62,88.01 58.1,91.53 R84.2
N$169
  Top 0.2: R85.1 53.19,93.6 52.76,93.17 IC11.4
N$170
  Top 0.2: LED85.A 65.17,43.42 65.17,64.43 61.98,67.63 61.98,89.72 58.1,93.6 R85.2
N$171
  Top 0.2: R86.1 55.05,95.57 53.92,94.44 IC11.5
N$172
  Top 0.2: R86.2 58.1,95.67 62.33,91.44 62.33,67.77 65.4,64.7 66.07,64.7 LED86.A
N$173
  Top 0.2: R87.1 55.05,97.63 53.22,95.81 52.17,95.81 IC11.6
N$174
  Top 0.2: LED87.A 68.21,59.91 68.21,63.85 67.01,65.05 65.55,65.05 62.68,67.92 62.68,93.15 58.1,97.73 R87.2
N$175
  Top 0.2: IC11.7 53.17,96.97 53.9,97.7 53.9,98.65 R88.1
N$176
  Top 0.2: LED88.A 68.56,55.78 68.56,63.99 67.15,65.41 65.69,65.41 63.03,68.07 63.03,94.87 58.1,99.8 R88.2
N$177
  Top 0.2: R89.1 53.38,2.2 48.06,7.53 IC12.15
N$178  (via drill 0.35)
  Top 0.2: R89.2 58.1,2.2 63.03,7.13 63.03,31.12 v67.52,35.6
  Bottom 0.2: LED89.A 68.92,48.43 68.92,37.88 67.52,36.48 v67.52,35.6
N$179
  Top 0.2: R90.1 55.05,4.37 53.26,6.16 52.17,6.16 IC12.1
N$180  (via drill 0.35)
  Top 0.2: R90.2 58.1,4.27 62.68,8.85 62.68,31.68 v66.61,35.6
  Bottom 0.2: LED90.A 68.56,44.3 68.56,38.03 66.61,36.07 v66.61,35.6
N$181
  Top 0.2: R91.1 55.05,6.43 53.96,7.53 IC12.2
N$182  (via drill 0.35)
  Top 0.2: R91.2 58.1,6.33 62.33,10.56 62.33,32.23 v65.7,35.6
  Bottom 0.2: LED91.A 68.21,40.18 68.21,38.18 65.7,35.66 v65.7,35.6
N$183
  Top 0.2: R92.1 53.15,8.4 52.76,8.79 IC12.3
N$184
  Top 0.2: R92.2 58.1,8.4 61.98,12.28 61.98,32.77 65.44,36.23 72.24,36.23 73.72,37.72 73.72,61.5 LED92.A
N$185
  Top 0.2: R93.1 53.16,10.47 52.76,10.06 IC12.4
N$186
  Top 0.2: R93.2 58.1,10.47 61.62,13.99 61.62,32.92 65.29,36.59 72.09,36.59 73.37,37.86 73.37,57.38 LED93.A
N$187
  Top 0.2: R94.1 55.05,12.43 53.95,11.34 IC12.5
N$188
  Top 0.2: R94.2 58.1,12.53 61.27,15.71 61.27,33.06 65.15,36.94 71.95,36.94 73.02,38.01 73.02,53.26 LED94.A
N$189
  Top 0.2: R95.1 55.05,14.5 53.26,12.71 52.17,12.71 IC12.6
N$190
  Top 0.2: R95.2 58.1,14.6 60.92,17.42 60.92,33.21 65,37.29 71.8,37.29 71.8,37.31 72.66,38.18 72.66,49.13 LED95.A
N$191
  Top 0.2: IC12.7 53.17,13.88 53.9,14.6 53.9,15.52 R96.1
N$192
  Top 0.2: R96.2 58.1,16.67 60.57,19.13 60.57,33.35 64.85,37.64 70.2,37.64 70.84,38.28 70.84,44.66 LED96.A
N$193  (via drill 0.35)
  Top 0.254: IC13.15 68.47,74.12 v68.5,74.1 | v74.6,68.8 R97.1
  Bottom 0.254: v68.5,74.1 73.8,68.8 v74.6,68.8
N$194  (via drill 0.35)
  Top 0.2: R97.2 77.95,67.8
  Top 0.254: 77.95,67.8 77.95,67.65 v77.6,67.3
  Bottom 0.254: v77.6,67.3 74.25,67.3 70.81,63.86 70.81,42.03 LED97.A
N$195
  Top 0.2: R98.1 76.05,70.97 74.26,72.75 73.17,72.75 IC13.1
N$196
  Top 0.2: R98.2 78.73,70.87 79.1,70.5 79.1,67.8 76.2,64.9 LED98.A
N$197
  Top 0.2: R99.1 76.05,73.03 74.96,74.12 IC13.2
N$198
  Top 0.2: LED99.A 77.11,59.91 77.11,65.31 79.45,67.65 79.45,72.58 79.1,72.93 R99.2
N$199
  Top 0.2: R100.1 74.15,75 73.76,75.39 IC13.3
N$200
  Top 0.2: LED100.A 77.47,55.78 77.47,65.17 79.81,67.51 79.81,74.3 79.1,75 R100.2
N$201
  Top 0.2: R101.1 74.16,77.07 73.76,76.67 IC13.4
N$202
  Top 0.2: LED101.A 77.82,51.66 77.82,65.02 80.16,67.36 80.16,76.01 79.1,77.07 R101.2
N$203
  Top 0.2: R102.1 76.05,79.03 74.95,77.94 IC13.5
N$204
  Top 0.2: LED102.A 78.17,47.54 78.17,64.88 80.51,67.22 80.51,77.72 79.1,79.13 R102.2
N$205
  Top 0.2: R103.1 76.05,81.1 74.25,79.31 73.17,79.31 IC13.6
N$206
  Top 0.2: LED103.A 78.52,43.42 78.52,64.73 80.86,67.07 80.86,79.44 79.1,81.2 R103.2
N$207
  Top 0.2: IC13.7 74.17,80.47 74.9,81.2 74.9,82.12 R104.1
N$208
  Top 0.2: R104.2 79.1,83.27 81.21,81.15 81.21,64.03 LED104.A
N$209  (via drill 0.35)
  Top 0.2: R105.1 v75.1,18.73 | IC14.15 v69,24.02
  Bottom 0.2: v69,24.02 74.29,18.73 v75.1,18.73
N$210
  Top 0.2: R105.2 79.6,18.73 81.71,20.85 81.71,32.53 82.97,33.79 82.97,56.67 LED105.A
N$211
  Top 0.2: R106.1 76.55,20.9 74.8,22.66 73.67,22.66 IC14.1
N$212
  Top 0.2: R106.2 79.6,20.8 81.36,22.56 81.36,32.68 82.62,33.94 82.62,52.55 LED106.A
N$213
  Top 0.2: R107.1 76.55,22.97 75.49,24.02 IC14.2
N$214
  Top 0.2: R107.2 79.6,22.87 81.01,24.28 81.01,32.83 82.27,34.09 82.27,48.43 LED107.A
N$215
  Top 0.2: R108.1 74.62,24.93 74.26,25.3 IC14.3
N$216
  Top 0.2: R108.2 79.6,24.93 80.66,25.99 80.66,32.97 81.92,34.23 81.92,44.3 LED108.A
N$217
  Top 0.2: R109.1 74.69,27 74.26,26.57 IC14.4
N$218
  Top 0.2: R109.2 79.6,27 80.31,27.7 80.31,33.12 81.56,34.38 81.56,40.18 LED109.A
N$219
  Top 0.2: R110.1 76.55,28.97 75.42,27.84 IC14.5
N$220  (via drill 0.35)
  Top 0.2: R110.2 79.6,29.07 79.95,29.42 79.95,33.66 v80.93,34.64
  Bottom 0.2: LED110.A 86.72,61.85 86.72,37.88 84.94,36.1 82.4,36.1 v80.93,34.64
N$221
  Top 0.2: R111.1 76.55,31.03 74.72,29.2 73.67,29.2 IC14.6
N$222  (via drill 0.35)
  Top 0.2: R111.2 79.23,31.13 79.6,31.5 79.6,34.22 v80.93,35.55
  Bottom 0.2: LED111.A 86.36,57.73 86.36,38.03 84.79,36.46 81.84,36.46 v80.93,35.55
N$223
  Top 0.2: IC14.7 74.67,30.38 75.4,31.1 75.4,32.05 R112.1
N$224  (via drill 0.35)
  Top 0.2: R112.2 78.45,34.2 80.71,36.46 v80.93,36.46
  Bottom 0.2: LED112.A 86.01,53.61 86.01,38.18 84.64,36.81 81.28,36.81 v80.93,36.46
N$225  (via drill 0.35)
  Top 0.254: R113.1 74.63,85.33 v74.6,85.3 | v68.5,90.6 68.47,90.62 IC15.15
  Bottom 0.254: v74.6,85.3 73.8,85.3 v68.5,90.6
N$226
  Top 0.2: R113.2 79.1,85.33 81.57,82.87 81.57,68.29 86.01,63.85 86.01,50.96 LED113.A
N$227
  Top 0.2: R114.1 76.05,87.5 74.3,89.25 73.17,89.25 IC15.1
N$228
  Top 0.2: R114.2 79.1,87.4 81.92,84.58 81.92,68.44 86.36,63.99 86.36,46.84 LED114.A
N$229
  Top 0.2: R115.1 76.05,89.57 74.99,90.62 IC15.2
N$230
  Top 0.2: R115.2 79.1,89.47 82.27,86.3 82.27,68.59 86.72,64.14 86.72,42.71 LED115.A
N$231
  Top 0.2: R116.1 74.12,91.53 73.76,91.89 IC15.3
N$232
  Top 0.2: R116.2 79.1,91.53 82.62,88.01 82.62,71.19 89.55,64.26 LED116.A
N$233
  Top 0.2: R117.1 74.19,93.6 73.76,93.17 IC15.4
N$234
  Top 0.2: R117.2 79.1,93.6 82.98,89.72 82.98,71.33 90.46,63.85 90.46,59.91 LED117.A
N$235
  Top 0.2: R118.1 76.05,95.57 74.92,94.44 IC15.5
N$236
  Top 0.2: R118.2 79.1,95.67 83.33,91.44 83.33,71.48 90.81,63.99 90.81,55.78 LED118.A
N$237
  Top 0.2: R119.1 76.05,97.63 74.22,95.81 73.17,95.81 IC15.6
N$238
  Top 0.2: R119.2 79.1,97.73 83.68,93.15 83.68,71.63 91.17,64.14 91.17,51.66 LED119.A
N$239
  Top 0.2: IC15.7 74.17,96.97 74.9,97.7 74.9,98.65 R120.1
N$240
  Top 0.2: R120.2 79.1,99.8 84.03,94.87 84.03,71.77 91.52,64.29 91.52,47.54 LED120.A
N$241
  Top 0.2: R121.1 74.89,2.2 69.56,7.53 IC16.15
N$242  (via drill 0.35)
  Top 0.2: R121.2 79.6,2.2 84.53,7.13 84.53,31.37 88.06,34.9 v89.11,34.9
  Bottom 0.2: LED121.A 90.46,40.18 90.46,36.25 v89.11,34.9
N$243
  Top 0.2: R122.1 76.55,4.37 74.76,6.16 73.67,6.16 IC16.1
N$244
  Top 0.2: R122.2 79.6,4.27 84.18,8.85 84.18,31.51 88.2,35.53 94.76,35.53 96.67,37.45 96.67,60.8 LED122.A
N$245
  Top 0.2: R123.1 76.55,6.43 75.46,7.53 IC16.2
N$246
  Top 0.2: R123.2 79.6,6.33 83.83,10.56 83.83,31.66 88.05,35.88 94.61,35.88 96.32,37.59 96.32,56.67 LED123.A
N$247
  Top 0.2: R124.1 74.65,8.4 74.26,8.79 IC16.3
N$248
  Top 0.2: R124.2 79.6,8.4 83.48,12.28 83.48,31.8 87.9,36.23 94.46,36.23 95.97,37.74 95.97,52.55 LED124.A
N$249
  Top 0.2: R125.1 74.66,10.47 74.26,10.06 IC16.4
N$250
  Top 0.2: R125.2 79.6,10.47 83.12,13.99 83.12,31.95 87.76,36.59 94.32,36.59 95.62,37.88 95.62,48.43 LED125.A
N$251
  Top 0.2: R126.1 76.55,12.43 75.45,11.34 IC16.5
N$252
  Top 0.2: R126.2 79.6,12.53 82.77,15.71 82.77,32.1 87.61,36.94 94.17,36.94 95.27,38.03 95.27,44.3 LED126.A
N$253
  Top 0.2: R127.1 76.55,14.5 74.75,12.71 73.67,12.71 IC16.6
N$254
  Top 0.2: R127.2 79.6,14.6 82.42,17.42 82.42,32.24 87.47,37.29 94.03,37.29 94.91,38.18 94.91,40.18 LED127.A
N$255
  Top 0.2: IC16.7 74.67,13.88 75.4,14.6 75.4,15.52 R128.1
N$256
  Top 0.2: R128.2 79.6,16.67 82.07,19.13 82.07,32.39 87.32,37.64 89.93,37.64 91.87,39.59 91.87,62.63 93.62,64.38 97.54,64.38 LED128.A
N$257  (via drill 0.35)
  Top 0.2: IC17.15 v89.5,74.12 | v95.6,68.8 R129.1
  Bottom 0.2: v89.5,74.12 94.83,68.8 v95.6,68.8
N$258
  Top 0.2: LED129.A 99.75,60.29 99.75,67.05 98.95,67.85 R129.2
N$259
  Top 0.2: R130.1 97.05,70.97 95.26,72.75 94.17,72.75 IC17.1
N$260
  Top 0.2: R130.2 99.73,70.87 100.1,70.5 100.1,56.17 LED130.A
N$261
  Top 0.2: R131.1 97.05,73.03 95.96,74.12 IC17.2
N$262
  Top 0.2: R131.2 100.1,72.93 100.45,72.58 100.45,52.05 LED131.A
N$263
  Top 0.2: R132.1 95.15,75 94.76,75.39 IC17.3
N$264
  Top 0.2: R132.2 100.1,75 100.81,74.3 100.81,47.92 LED132.A
N$265
  Top 0.2: R133.1 95.16,77.07 94.76,76.67 IC17.4
N$266
  Top 0.2: R133.2 100.1,77.07 101.16,76.01 101.16,43.8 LED133.A
N$267
  Top 0.2: R134.1 97.05,79.03 95.95,77.94 IC17.5
N$268
  Top 0.2: R134.2 100.1,79.13 101.51,77.72 101.51,65.65 102.9,64.26 LED134.A
N$269
  Top 0.2: R135.1 97.05,81.1 95.25,79.31 94.17,79.31 IC17.6
N$270
  Top 0.2: R135.2 100.1,81.2 101.86,79.44 101.86,65.8 103.81,63.85 103.81,59.91 LED135.A
N$271
  Top 0.2: IC17.7 95.17,80.47 95.9,81.2 95.9,82.12 R136.1
N$272
  Top 0.2: R136.2 100.1,83.27 102.21,81.15 102.21,65.94 104.17,63.99 104.17,55.78 LED136.A
N$273
  Top 0.2: R137.1 95.85,18.73 90.56,24.02 IC18.15
N$274
  Top 0.2: R137.2 100.6,18.73 102.71,20.85 102.71,32.85 104.52,34.66 104.52,48.43 LED137.A
N$275
  Top 0.2: R138.1 97.55,20.9 95.8,22.66 94.67,22.66 IC18.1
N$276
  Top 0.2: R138.2 100.6,20.8 102.36,22.56 102.36,33 104.17,34.8 104.17,44.3 LED138.A
N$277
  Top 0.2: R139.1 97.55,22.97 96.49,24.02 IC18.2
N$278
  Top 0.2: R139.2 100.6,22.87 102.01,24.28 102.01,33.15 103.81,34.95 103.81,40.18 LED139.A
N$279
  Top 0.2: R140.1 95.62,24.93 95.26,25.3 IC18.3
N$280
  Top 0.2: R140.2 100.6,24.93 101.66,25.99 101.66,33.29 102.9,34.54 102.9,37.26 101.99,38.18 101.99,52.36 102.56,52.93 103.47,52.93 106.44,55.9 106.44,62.56 LED140.A
N$281
  Top 0.2: R141.1 95.69,27 95.26,26.57 IC18.4
N$282  (via drill 0.35)
  Top 0.2: R141.2 100.6,27 101.31,27.7 101.31,33.83 v102.27,34.8
  Bottom 0.2: LED141.A 109.32,57.02 109.32,37.71 107.04,35.43 102.9,35.43 v102.27,34.8
N$283
  Top 0.2: R142.1 97.55,28.97 96.42,27.84 IC18.5
N$284  (via drill 0.35)
  Top 0.2: R142.2 100.6,29.07 100.95,29.42 100.95,34.39 v101.36,34.8
  Bottom 0.2: LED142.A 108.97,52.9 108.97,37.86 106.89,35.78 102.35,35.78 v101.36,34.8
N$285
  Top 0.2: R143.1 97.55,31.03 95.72,29.2 94.67,29.2 IC18.6
N$286  (via drill 0.35)
  Top 0.2: R143.2 100.23,31.13 100.6,31.5 100.6,34.66 v100.46,34.8
  Bottom 0.2: LED143.A 108.61,48.78 108.61,38.01 106.75,36.13 101.79,36.13 v100.46,34.8
N$287
  Top 0.2: IC18.7 95.67,30.38 96.4,31.1 96.4,32.05 R144.1
N$288  (via drill 0.35)
  Top 0.2: R144.2 99.55,33.3 v99.55,34.8
  Bottom 0.2: LED144.A 108.26,44.66 108.26,38.15 106.6,36.49 101.23,36.49 v99.55,34.8
N$289  (via drill 0.35)
  Top 0.254: IC1.9 5.46,81.75 v5.5,81.7 | IC2.14 5.2,25.3 7.01,27.11 7.01,32.84 3.65,36.2 3.65,64.03 6.9,67.27 v6.9,81.7
  Bottom 0.254: v6.9,81.7 v5.5,81.7
N$290
  Top 0.254: IC3.14 5.21,91.89 5.85,91.25 5.85,91.2 6.16,90.9 6.16,67.11 3.25,64.2 3.25,31.72 3.33,31.64 IC2.9
N$291
  Top 0.254: IC4.14 5.5,8.8 8.4,11.7 8.4,32.03 4.06,36.37 4.06,63.86 7.6,67.4 7.6,95.8 5.16,98.25 IC3.9
N$292  (via drill 0.35)
  Top 0.254: IC4.9 5.04,15.14 7.67,17.77 v7.67,31.8 | IC5.14 24.97,75.44 v26.5,75.44
  Bottom 0.254: v7.67,31.8 7.67,64.07 19.04,75.44 v26.5,75.44
N$293  (via drill 0.35)
  Top 0.254: IC6.14 26.2,25.3 27.4,26.5 v27.4,31.8 | IC5.9 26.05,81.75 27.5,80.3 v27.5,74.1
  Bottom 0.254: v27.4,31.8 25.8,33.4 25.8,74.57 26.02,74.78 26.82,74.78 v27.5,74.1
N$294
  Top 0.254: IC7.14 26.16,91.89 27.16,90.9 28.19,89.86 28.19,63.08 27.39,62.28 26.69,62.28 25.9,61.49 25.9,31.82 25.73,31.64 IC6.9
N$295
  Top 0.254: IC8.14 26.5,8.79 29.32,11.62 29.32,35.16 26.31,38.17 26.31,61.32 26.86,61.87 27.55,61.87 28.6,62.91 28.6,95.7 26.05,98.25 IC7.9
N$296  (via drill 0.35)
  Top 0.254: IC8.9 26.05,15.14 28.66,17.76 v28.66,31.8 | v47.5,75.4 v47.49,75.39 IC9.14
  Bottom 0.254: v47.5,75.4 41.5,75.4 30.6,64.5 30.6,33.74 v28.66,31.8
N$297  (via drill 0.35)
  Top 0.254: IC9.9 47.45,81.75 v47.5,81.8 | IC10.14 47.2,25.3 48.26,26.36 48.26,32.77 48.15,32.88 48.15,73.23 48.81,73.89 v48.81,81.8
  Bottom 0.254: v48.81,81.8 v47.5,81.8
N$298
  Top 0.254: IC11.14 47.3,91.9 48.16,91.04 48.16,73.81 47.75,73.4 47.75,32.35 47.05,31.64 IC10.9
N$299
  Top 0.254: IC12.14 47.49,8.79 49.66,10.96 49.66,32.07 48.56,33.17 48.56,73.06 49.5,74 49.5,95.8 47.05,98.25 IC11.9
N$300  (via drill 0.35)
  Top 0.254: IC13.14 v68.5,75.4 | IC12.9 47.05,15.14 49,17.1 v49,31.8
  Bottom 0.254: v68.5,75.4 63.7,75.4 51.91,63.61 51.91,34.71 v49,31.8
N$301  (via drill 0.35)
  Top 0.254: IC13.9 68.44,81.75 v68.5,81.8 | IC14.14 68.69,25.3 70.52,27.11 70.52,32.92 74.85,37.26 74.85,66.25 69.9,71.2 v69.9,81.8
  Bottom 0.254: v69.9,81.8 v68.5,81.8
N$302
  Top 0.254: IC15.14 68.2,91.9 69.2,90.9 69.2,71.3 74.45,66.05 74.45,37.43 68.66,31.64 IC14.9
N$303
  Top 0.254: IC16.14 69,8.79 71.33,11.13 71.33,31.53 75.26,35.46 75.26,66.44 70.56,71.14 70.56,95.79 68.1,98.25 IC15.9
N$304  (via drill 0.35)
  Top 0.254: v89.5,75.4 v89.5,75.39 IC17.14 | IC16.9 68.55,15.14 70.92,17.52 70.92,32.32 v74.5,35.9
  Bottom 0.254: v89.5,75.4 87,75.4 80.5,68.9 80.5,65.4 78.5,63.4 78.5,38.5 75.9,35.9 v74.5,35.9
N$305  (via drill 0.35)
  Top 0.254: IC18.14 89.69,25.3 92.55,28.15 v92.55,31.7 | IC17.9 89.06,81.75 91,79.8 91,65.5 v92.3,64.2
  Bottom 0.254: v92.3,64.2 92.5,64 92.5,31.75 v92.55,31.7

## Text on the board
tPlace: GND | +5V | A8 | A9 | A10
tNames: GKN FOKKER ELMO